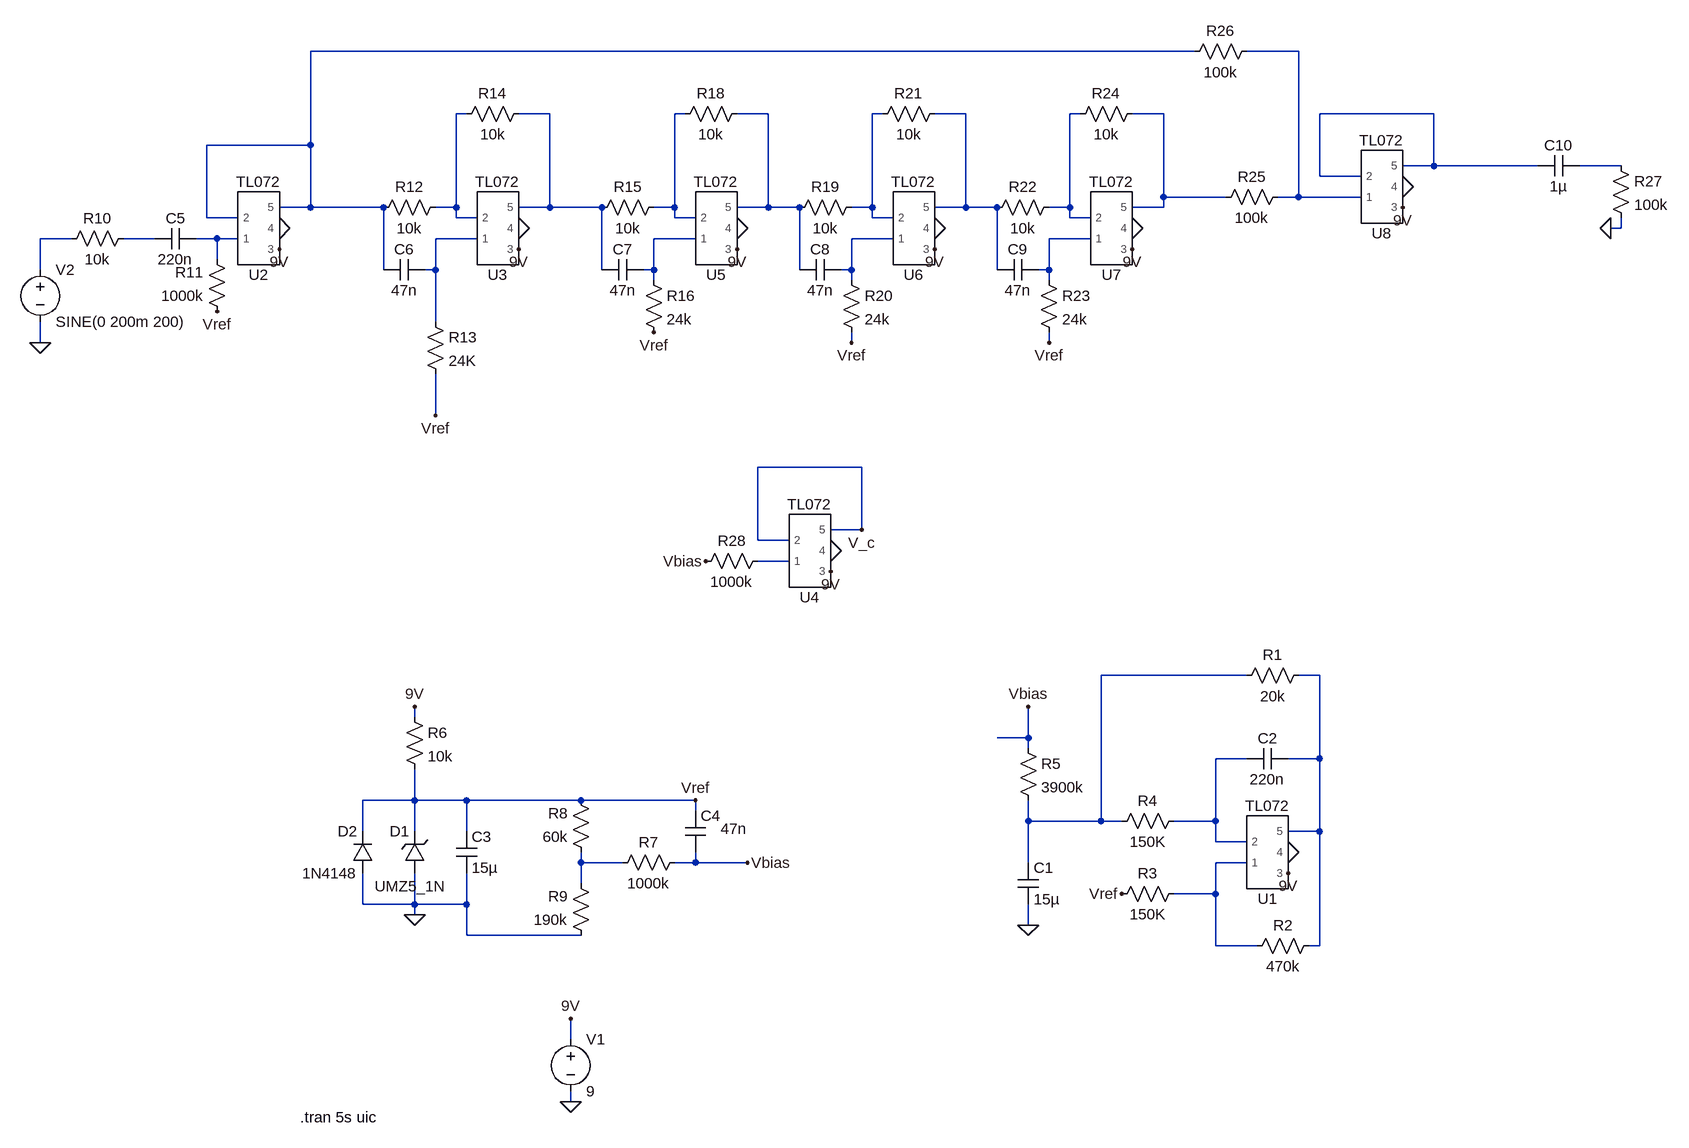
[diagram p0: schematic Draft1.asc]
Draft1.asc, the LTspice schematic file:
Version 4
SHEET 1 1056 680
WIRE 320 -1200 -1040 -1200
WIRE 480 -1200 400 -1200
WIRE -800 -1104 -816 -1104
WIRE -672 -1104 -720 -1104
WIRE -464 -1104 -480 -1104
WIRE -336 -1104 -384 -1104
WIRE -160 -1104 -176 -1104
WIRE -32 -1104 -80 -1104
WIRE 144 -1104 128 -1104
WIRE 272 -1104 224 -1104
WIRE 688 -1104 512 -1104
WIRE -1040 -1056 -1040 -1200
WIRE -1040 -1056 -1200 -1056
WIRE 688 -1024 688 -1104
WIRE 688 -1024 640 -1024
WIRE 848 -1024 688 -1024
WIRE 976 -1024 912 -1024
WIRE 512 -1008 512 -1104
WIRE 576 -1008 512 -1008
WIRE 272 -976 272 -1104
WIRE 368 -976 272 -976
WIRE 480 -976 480 -1200
WIRE 480 -976 448 -976
WIRE 576 -976 480 -976
WIRE -1040 -960 -1040 -1056
WIRE -1040 -960 -1088 -960
WIRE -928 -960 -1040 -960
WIRE -816 -960 -816 -1104
WIRE -816 -960 -848 -960
WIRE -672 -960 -672 -1104
WIRE -672 -960 -720 -960
WIRE -592 -960 -672 -960
WIRE -480 -960 -480 -1104
WIRE -480 -960 -512 -960
WIRE -336 -960 -336 -1104
WIRE -336 -960 -384 -960
WIRE -288 -960 -336 -960
WIRE -176 -960 -176 -1104
WIRE -176 -960 -208 -960
WIRE -32 -960 -32 -1104
WIRE -32 -960 -80 -960
WIRE 16 -960 -32 -960
WIRE 128 -960 128 -1104
WIRE 128 -960 96 -960
WIRE 272 -960 272 -976
WIRE 272 -960 224 -960
WIRE -1200 -944 -1200 -1056
WIRE -1152 -944 -1200 -944
WIRE -816 -944 -816 -960
WIRE -784 -944 -816 -944
WIRE -480 -944 -480 -960
WIRE -448 -944 -480 -944
WIRE -176 -944 -176 -960
WIRE -144 -944 -176 -944
WIRE 128 -944 128 -960
WIRE 160 -944 128 -944
WIRE 976 -928 976 -944
WIRE 976 -928 960 -928
WIRE -1408 -912 -1456 -912
WIRE -1280 -912 -1328 -912
WIRE -1184 -912 -1216 -912
WIRE -1152 -912 -1184 -912
WIRE -784 -912 -848 -912
WIRE -448 -912 -512 -912
WIRE -144 -912 -208 -912
WIRE 160 -912 96 -912
WIRE -1184 -880 -1184 -912
WIRE -1456 -864 -1456 -912
WIRE -928 -864 -928 -960
WIRE -848 -864 -848 -912
WIRE -848 -864 -864 -864
WIRE -592 -864 -592 -960
WIRE -512 -864 -512 -912
WIRE -512 -864 -528 -864
WIRE -288 -864 -288 -960
WIRE -208 -864 -208 -912
WIRE -208 -864 -224 -864
WIRE 16 -864 16 -960
WIRE 96 -864 96 -912
WIRE 96 -864 80 -864
WIRE -512 -848 -512 -864
WIRE -208 -848 -208 -864
WIRE 96 -848 96 -864
WIRE -848 -784 -848 -864
WIRE -1456 -752 -1456 -784
WIRE -208 -752 -208 -768
WIRE 96 -752 96 -768
WIRE -848 -640 -848 -704
WIRE -192 -560 -352 -560
WIRE -192 -464 -192 -560
WIRE -192 -464 -240 -464
WIRE -352 -448 -352 -560
WIRE -304 -448 -352 -448
WIRE -304 -416 -352 -416
WIRE 400 -240 176 -240
WIRE 512 -240 480 -240
WIRE -880 -176 -880 -192
WIRE 64 -144 64 -192
WIRE 64 -144 16 -144
WIRE 64 -128 64 -144
WIRE 400 -112 352 -112
WIRE 512 -112 512 -240
WIRE 512 -112 464 -112
WIRE -880 -48 -880 -96
WIRE -880 -48 -960 -48
WIRE -800 -48 -880 -48
WIRE -624 -48 -800 -48
WIRE -448 -48 -624 -48
WIRE -448 -32 -448 -48
WIRE 64 -16 64 -48
WIRE 176 -16 176 -240
WIRE 176 -16 64 -16
WIRE 208 -16 176 -16
WIRE 352 -16 352 -112
WIRE 352 -16 288 -16
WIRE -960 0 -960 -48
WIRE -880 0 -880 -48
WIRE -800 0 -800 -48
WIRE 512 0 512 -112
WIRE 512 0 464 0
WIRE 352 16 352 -16
WIRE 400 16 352 16
WIRE -624 48 -624 32
WIRE -560 48 -624 48
WIRE -448 48 -448 32
WIRE -448 48 -480 48
WIRE -368 48 -448 48
WIRE 64 48 64 -16
WIRE 400 48 352 48
WIRE -624 80 -624 48
WIRE 352 96 352 48
WIRE 352 96 288 96
WIRE -960 112 -960 64
WIRE -880 112 -880 64
WIRE -880 112 -960 112
WIRE -800 112 -800 64
WIRE -800 112 -880 112
WIRE -880 128 -880 112
WIRE 64 144 64 112
WIRE -800 160 -800 112
WIRE -624 160 -800 160
WIRE 352 176 352 96
WIRE 416 176 352 176
WIRE 512 176 512 0
WIRE 512 176 496 176
WIRE -640 320 -640 288
WIRE -640 416 -640 400
FLAG -640 416 0
FLAG -640 288 9V
FLAG 464 32 0
FLAG 464 64 9V
FLAG 208 96 Vref
FLAG 64 144 0
FLAG -880 -192 9V
FLAG -880 128 0
FLAG -448 -48 Vref
FLAG -368 48 Vbias
FLAG 64 -192 Vbias
FLAG -1184 -800 Vref
FLAG -1456 -752 0
FLAG -1088 -928 0
FLAG -1088 -896 9V
FLAG -720 -928 0
FLAG -720 -896 9V
FLAG -240 -432 0
FLAG -240 -400 9V
FLAG -192 -464 V_c
FLAG -384 -928 0
FLAG -384 -896 9V
FLAG -80 -928 0
FLAG -80 -896 9V
FLAG 224 -928 0
FLAG 224 -896 9V
FLAG 640 -992 0
FLAG 640 -960 9V
FLAG 960 -928 0
FLAG 96 -752 Vref
FLAG -848 -640 Vref
FLAG -208 -752 Vref
FLAG -432 -416 Vbias
FLAG -512 -768 Vref
SYMBOL TL072 432 32 M180
SYMATTR InstName U1
SYMBOL res 496 -256 R90
WINDOW 0 0 56 VBottom 2
WINDOW 3 32 56 VTop 2
SYMATTR InstName R1
SYMATTR Value 20k
SYMBOL res 512 160 R90
WINDOW 0 0 56 VBottom 2
WINDOW 3 32 56 VTop 2
SYMATTR InstName R2
SYMATTR Value 470k
SYMBOL res 304 80 R90
WINDOW 0 0 56 VBottom 2
WINDOW 3 32 56 VTop 2
SYMATTR InstName R3
SYMATTR Value 150K
SYMBOL res 304 -32 R90
WINDOW 0 0 56 VBottom 2
WINDOW 3 32 56 VTop 2
SYMATTR InstName R4
SYMATTR Value 150K
SYMBOL res 48 -144 R0
SYMATTR InstName R5
SYMATTR Value 3900k
SYMBOL cap 48 48 R0
SYMATTR InstName C1
SYMATTR Value 15µ
SYMBOL cap 464 -128 R90
WINDOW 0 0 32 VBottom 2
WINDOW 3 32 32 VTop 2
SYMATTR InstName C2
SYMATTR Value 220n
SYMBOL voltage -640 304 R0
WINDOW 123 0 0 Left 0
WINDOW 39 0 0 Left 0
SYMATTR InstName V1
SYMATTR Value 9
SYMBOL res -896 -192 R0
SYMATTR InstName R6
SYMATTR Value 10k
SYMBOL zener -864 64 R180
WINDOW 0 24 64 Left 2
WINDOW 3 -33 -20 Left 2
SYMATTR InstName D1
SYMATTR Value UMZ5_1N
SYMATTR Description Diode
SYMATTR Type diode
SYMBOL diode -944 64 R180
WINDOW 0 24 64 Left 2
WINDOW 3 24 0 Left 2
SYMATTR InstName D2
SYMATTR Value 1N4148
SYMBOL cap -816 0 R0
SYMATTR InstName C3
SYMATTR Value 15µ
SYMBOL res -464 32 R90
WINDOW 0 0 56 VBottom 2
WINDOW 3 32 56 VTop 2
SYMATTR InstName R7
SYMATTR Value 1000k
SYMBOL res -608 48 R180
WINDOW 0 36 76 Left 2
WINDOW 3 36 40 Left 2
SYMATTR InstName R8
SYMATTR Value 60k
SYMBOL res -608 176 R180
WINDOW 0 36 76 Left 2
WINDOW 3 36 40 Left 2
SYMATTR InstName R9
SYMATTR Value 190k
SYMBOL cap -464 -32 R0
WINDOW 3 55 28 Left 2
SYMATTR InstName C4
SYMATTR Value 47n
SYMBOL voltage -1456 -880 R0
WINDOW 123 0 0 Left 0
WINDOW 39 0 0 Left 0
SYMATTR InstName V2
SYMATTR Value SINE(0 200m 200)
SYMBOL TL072 -1120 -928 M180
SYMATTR InstName U2
SYMBOL cap -1216 -928 R90
WINDOW 0 0 32 VBottom 2
WINDOW 3 32 32 VTop 2
SYMATTR InstName C5
SYMATTR Value 220n
SYMBOL res -1312 -928 R90
WINDOW 0 0 56 VBottom 2
WINDOW 3 32 56 VTop 2
SYMATTR InstName R10
SYMATTR Value 10k
SYMBOL res -1168 -784 R180
WINDOW 0 36 76 Left 2
WINDOW 3 36 40 Left 2
SYMATTR InstName R11
SYMATTR Value 1000k
SYMBOL TL072 -752 -928 M180
SYMATTR InstName U3
SYMBOL res -832 -976 R90
WINDOW 0 0 56 VBottom 2
WINDOW 3 32 56 VTop 2
SYMATTR InstName R12
SYMATTR Value 10k
SYMBOL res -864 -800 R0
SYMATTR InstName R13
SYMATTR Value 24K
SYMBOL cap -864 -880 R90
WINDOW 0 0 32 VBottom 2
WINDOW 3 32 32 VTop 2
SYMATTR InstName C6
SYMATTR Value 47n
SYMBOL res -704 -1120 R90
WINDOW 0 0 56 VBottom 2
WINDOW 3 32 56 VTop 2
SYMATTR InstName R14
SYMATTR Value 10k
SYMBOL TL072 -272 -432 M180
SYMATTR InstName U4
SYMBOL TL072 -416 -928 M180
SYMATTR InstName U5
SYMBOL res -496 -976 R90
WINDOW 0 0 56 VBottom 2
WINDOW 3 32 56 VTop 2
SYMATTR InstName R15
SYMATTR Value 10k
SYMBOL res -528 -864 R0
SYMATTR InstName R16
SYMATTR Value 24k
SYMBOL cap -528 -880 R90
WINDOW 0 0 32 VBottom 2
WINDOW 3 32 32 VTop 2
SYMATTR InstName C7
SYMATTR Value 47n
SYMBOL res -368 -1120 R90
WINDOW 0 0 56 VBottom 2
WINDOW 3 32 56 VTop 2
SYMATTR InstName R18
SYMATTR Value 10k
SYMBOL TL072 -112 -928 M180
SYMATTR InstName U6
SYMBOL res -192 -976 R90
WINDOW 0 0 56 VBottom 2
WINDOW 3 32 56 VTop 2
SYMATTR InstName R19
SYMATTR Value 10k
SYMBOL res -224 -864 R0
SYMATTR InstName R20
SYMATTR Value 24k
SYMBOL cap -224 -880 R90
WINDOW 0 0 32 VBottom 2
WINDOW 3 32 32 VTop 2
SYMATTR InstName C8
SYMATTR Value 47n
SYMBOL res -64 -1120 R90
WINDOW 0 0 56 VBottom 2
WINDOW 3 32 56 VTop 2
SYMATTR InstName R21
SYMATTR Value 10k
SYMBOL TL072 192 -928 M180
SYMATTR InstName U7
SYMBOL res 112 -976 R90
WINDOW 0 0 56 VBottom 2
WINDOW 3 32 56 VTop 2
SYMATTR InstName R22
SYMATTR Value 10k
SYMBOL res 80 -864 R0
SYMATTR InstName R23
SYMATTR Value 24k
SYMBOL cap 80 -880 R90
WINDOW 0 0 32 VBottom 2
WINDOW 3 32 32 VTop 2
SYMATTR InstName C9
SYMATTR Value 47n
SYMBOL res 240 -1120 R90
WINDOW 0 0 56 VBottom 2
WINDOW 3 32 56 VTop 2
SYMATTR InstName R24
SYMATTR Value 10k
SYMBOL TL072 608 -992 M180
SYMATTR InstName U8
SYMBOL res 464 -992 R90
WINDOW 0 0 56 VBottom 2
WINDOW 3 32 56 VTop 2
SYMATTR InstName R25
SYMATTR Value 100k
SYMBOL res 416 -1216 R90
WINDOW 0 0 56 VBottom 2
WINDOW 3 32 56 VTop 2
SYMATTR InstName R26
SYMATTR Value 100k
SYMBOL cap 912 -1040 R90
WINDOW 0 0 32 VBottom 2
WINDOW 3 32 32 VTop 2
SYMATTR InstName C10
SYMATTR Value 1µ
SYMBOL res 960 -1040 R0
SYMATTR InstName R27
SYMATTR Value 100k
SYMBOL res -336 -432 R90
WINDOW 0 0 56 VBottom 2
WINDOW 3 32 56 VTop 2
SYMATTR InstName R28
SYMATTR Value 1000k
TEXT -1056 440 Left 2 !.tran 5s uic

The netlist it stands for:
* Draft1.asc
XU1 N025 N023 9V 0 N022 TL072  ; pins 1 2 3 4 5
R1 N022 N021 20k
R2 N022 N025 470k
R3 N025 Vref 150K
R4 N023 N021 150K
R5 Vbias N021 3900k
C1 N021 0 15µ
C2 N022 N023 220n
V1 9V 0 9
R6 9V Vref 10k
D1 0 Vref UMZ5_1N
D2 0 Vref 1N4148
C3 Vref 0 15µ
R7 Vbias N024 1000k
R8 N024 Vref 60k
R9 0 N024 190k
C4 Vref Vbias 47n
V2 N013 0 SINE(0 200m 200)
XU2 N015 N001 9V 0 N001 TL072  ; pins 1 2 3 4 5
C5 N015 N014 220n
R10 N014 N013 10k
R11 Vref N015 1000k
XU3 N016 N003 9V 0 N004 TL072  ; pins 1 2 3 4 5
R12 N003 N001 10k
R13 N016 Vref 24K
C6 N016 N001 47n
R14 N004 N003 10k
XU4 N020 V_c 9V 0 V_c TL072  ; pins 1 2 3 4 5
XU5 N017 N005 9V 0 N006 TL072  ; pins 1 2 3 4 5
R15 N005 N004 10k
R16 N017 Vref 24k
C7 N017 N004 47n
R18 N006 N005 10k
XU6 N018 N007 9V 0 N008 TL072  ; pins 1 2 3 4 5
R19 N007 N006 10k
R20 N018 Vref 24k
C8 N018 N006 47n
R21 N008 N007 10k
XU7 N019 N009 9V 0 N010 TL072  ; pins 1 2 3 4 5
R22 N009 N008 10k
R23 N019 Vref 24k
C9 N019 N008 47n
R24 N010 N009 10k
XU8 N002 N011 9V 0 N011 TL072  ; pins 1 2 3 4 5
R25 N002 N010 100k
R26 N002 N001 100k
C10 N012 N011 1µ
R27 N012 0 100k
R28 N020 Vbias 1000k
.model D D
.lib standard.dio
.tran 5s uic
.lib C:\Users\Usuario\Documents\Proyecto_Pedal\Overdrive-guitar-pedal-project\Simulaciones\TL072.lib
.backanno
.end